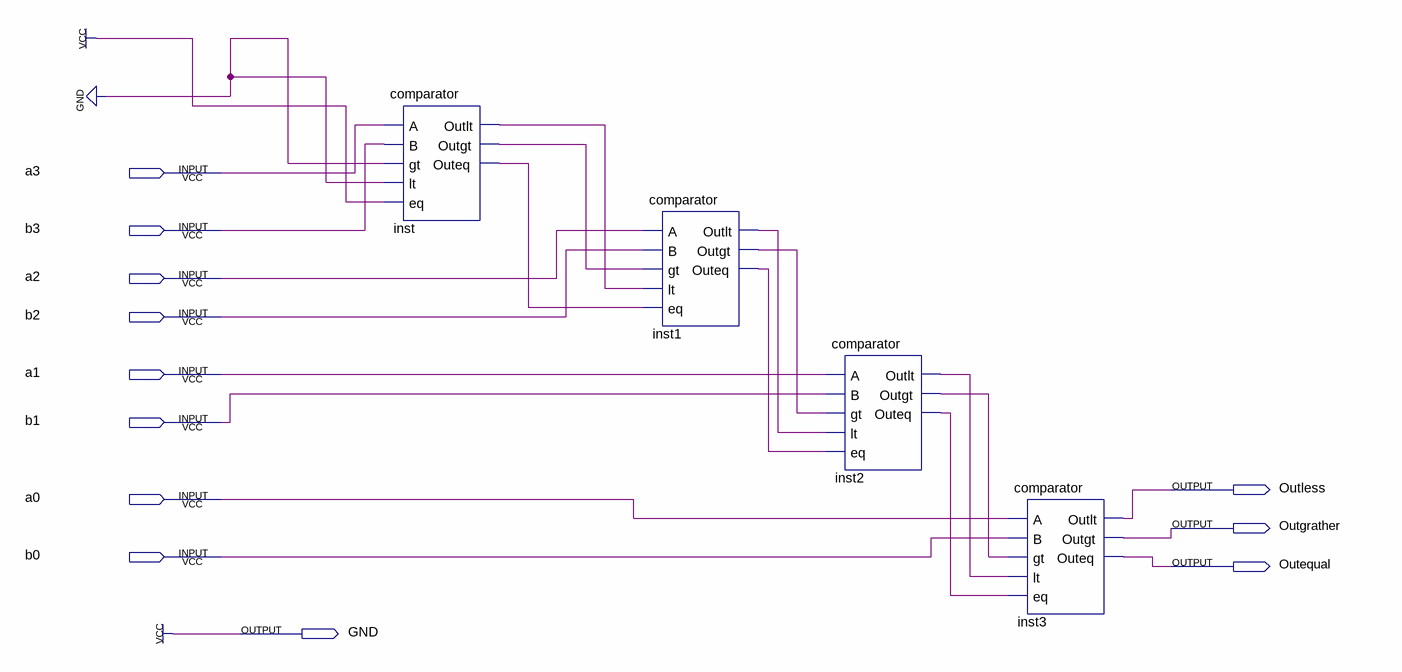
[diagram p0: schematic sheet]
// Quartus schematic 4bitscomparator.bdf as structural Verilog: 4 symbols, 12 pins
module \4bitscomparator  (
  input  a3,
  input  b3,
  input  a2,
  input  b2,
  input  a1,
  input  b1,
  input  a0,
  input  b0,
  output Outless,
  output Outgrather,
  output Outequal,
  output GND
);

  wire inst1_outeq, inst1_outgt, inst1_outlt, inst2_outeq, inst2_outgt, inst2_outlt, inst_outeq, inst_outgt,
       inst_outlt;

  comparator inst (
    .A(a3), .B(b3), .gt(1'b0), .lt(1'b0), .eq(1'b1), .Outlt(inst_outlt), .Outgt(inst_outgt),
    .Outeq(inst_outeq));
  comparator inst1 (
    .A(a2), .B(b2), .gt(inst_outgt), .lt(inst_outlt), .eq(inst_outeq), .Outlt(inst1_outlt),
    .Outgt(inst1_outgt), .Outeq(inst1_outeq));
  comparator inst2 (
    .A(a1), .B(b1), .gt(inst1_outgt), .lt(inst1_outlt), .eq(inst1_outeq), .Outlt(inst2_outlt),
    .Outgt(inst2_outgt), .Outeq(inst2_outeq));
  comparator inst3 (
    .A(a0), .B(b0), .gt(inst2_outgt), .lt(inst2_outlt), .eq(inst2_outeq), .Outlt(Outless),
    .Outgt(Outgrather), .Outeq(Outequal));

  assign GND = 1'b1;
endmodule
